# Altium schematic sheet Shield.SchDoc: uStepper S Proto Shield
size A3; DocumentNumber: 2; SheetNumber: 2; SheetTotal: 2
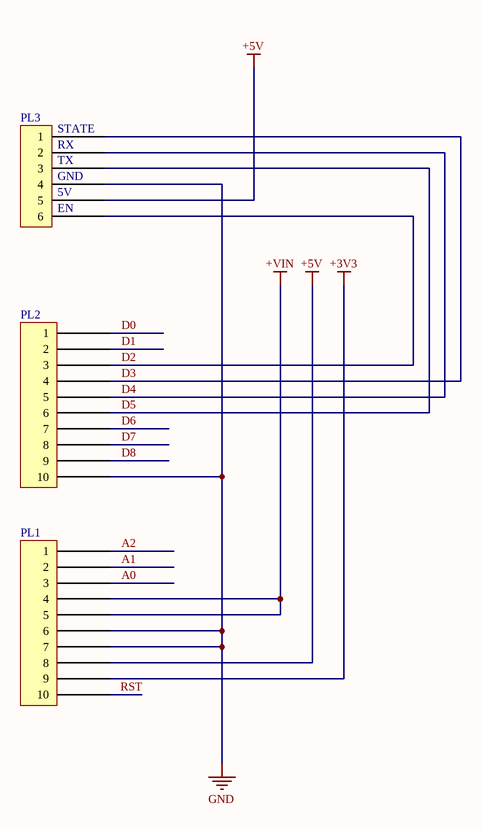
[diagram p0: Shield.SchDoc]

## Parts
PL1  10-pin Male Header 2.54mm  [10-pin 2.54mm header]  (value not drawn)
PL2  10-pin Male Header 2.54mm  [10-pin 2.54mm header]  (value not drawn)
PL3  6-pin 2.54mm female right angle  [6-pin 2.54mm header - female right angle]  (value not drawn)

## Nets
+3V3: PL1.9
+5V: PL1.8 PL3.5
+VIN: PL1.4 PL1.5
GND: PL1.6 PL1.7 PL2.10 PL3.4
A0: PL1.3
A1: PL1.2
A2: PL1.1
D0: PL2.1
D1: PL2.2
D2: PL2.3 PL3.6
D3: PL2.4 PL3.1
D4: PL2.5 PL3.2
D5: PL2.6 PL3.3
D6: PL2.7
D7: PL2.8
D8: PL2.9
RST: PL1.10

## Notes on the sheet
- (near PL3) STATE
- (near PL3) RX
- (near PL3) TX
- (near PL3) GND
- (near PL3) 5V
- (near PL3) EN
- ON Development IVS
- Title:
- Size:
- A3
- Drawn By:
- Date:
- Sheet
- of
- Revision:

## Library data of the parts
PL1 PL2 = CMP-003-0020-0.0: 10 Positions Header Connector 0.100" (2.54mm) Through Hole Gold
PL3 = CMP-003-0023-0.1: Pin Header 6-pin 2.54mm female right angle